# Altium schematic sheet ESP32.SchDoc: ESP32 S3 MQTT SUBSYSTEM
size B; Author: K VOLIN; CompanyName: ASU; DrawnBy: KVOLIN; Engineer: KVOLIN; Revision: 1; SheetNumber: 1; SheetTotal: 1; SPICEModelCachePHAJWFKO: <root> / <DocumentId>PHAJWFKO</DocumentId> / <CacheFrame Number="0"> / <Model Name="diode" Kind="MDL"> / <Text>.MODEL diode D ()</Text> / </Model> / </CacheFrame> / </root>
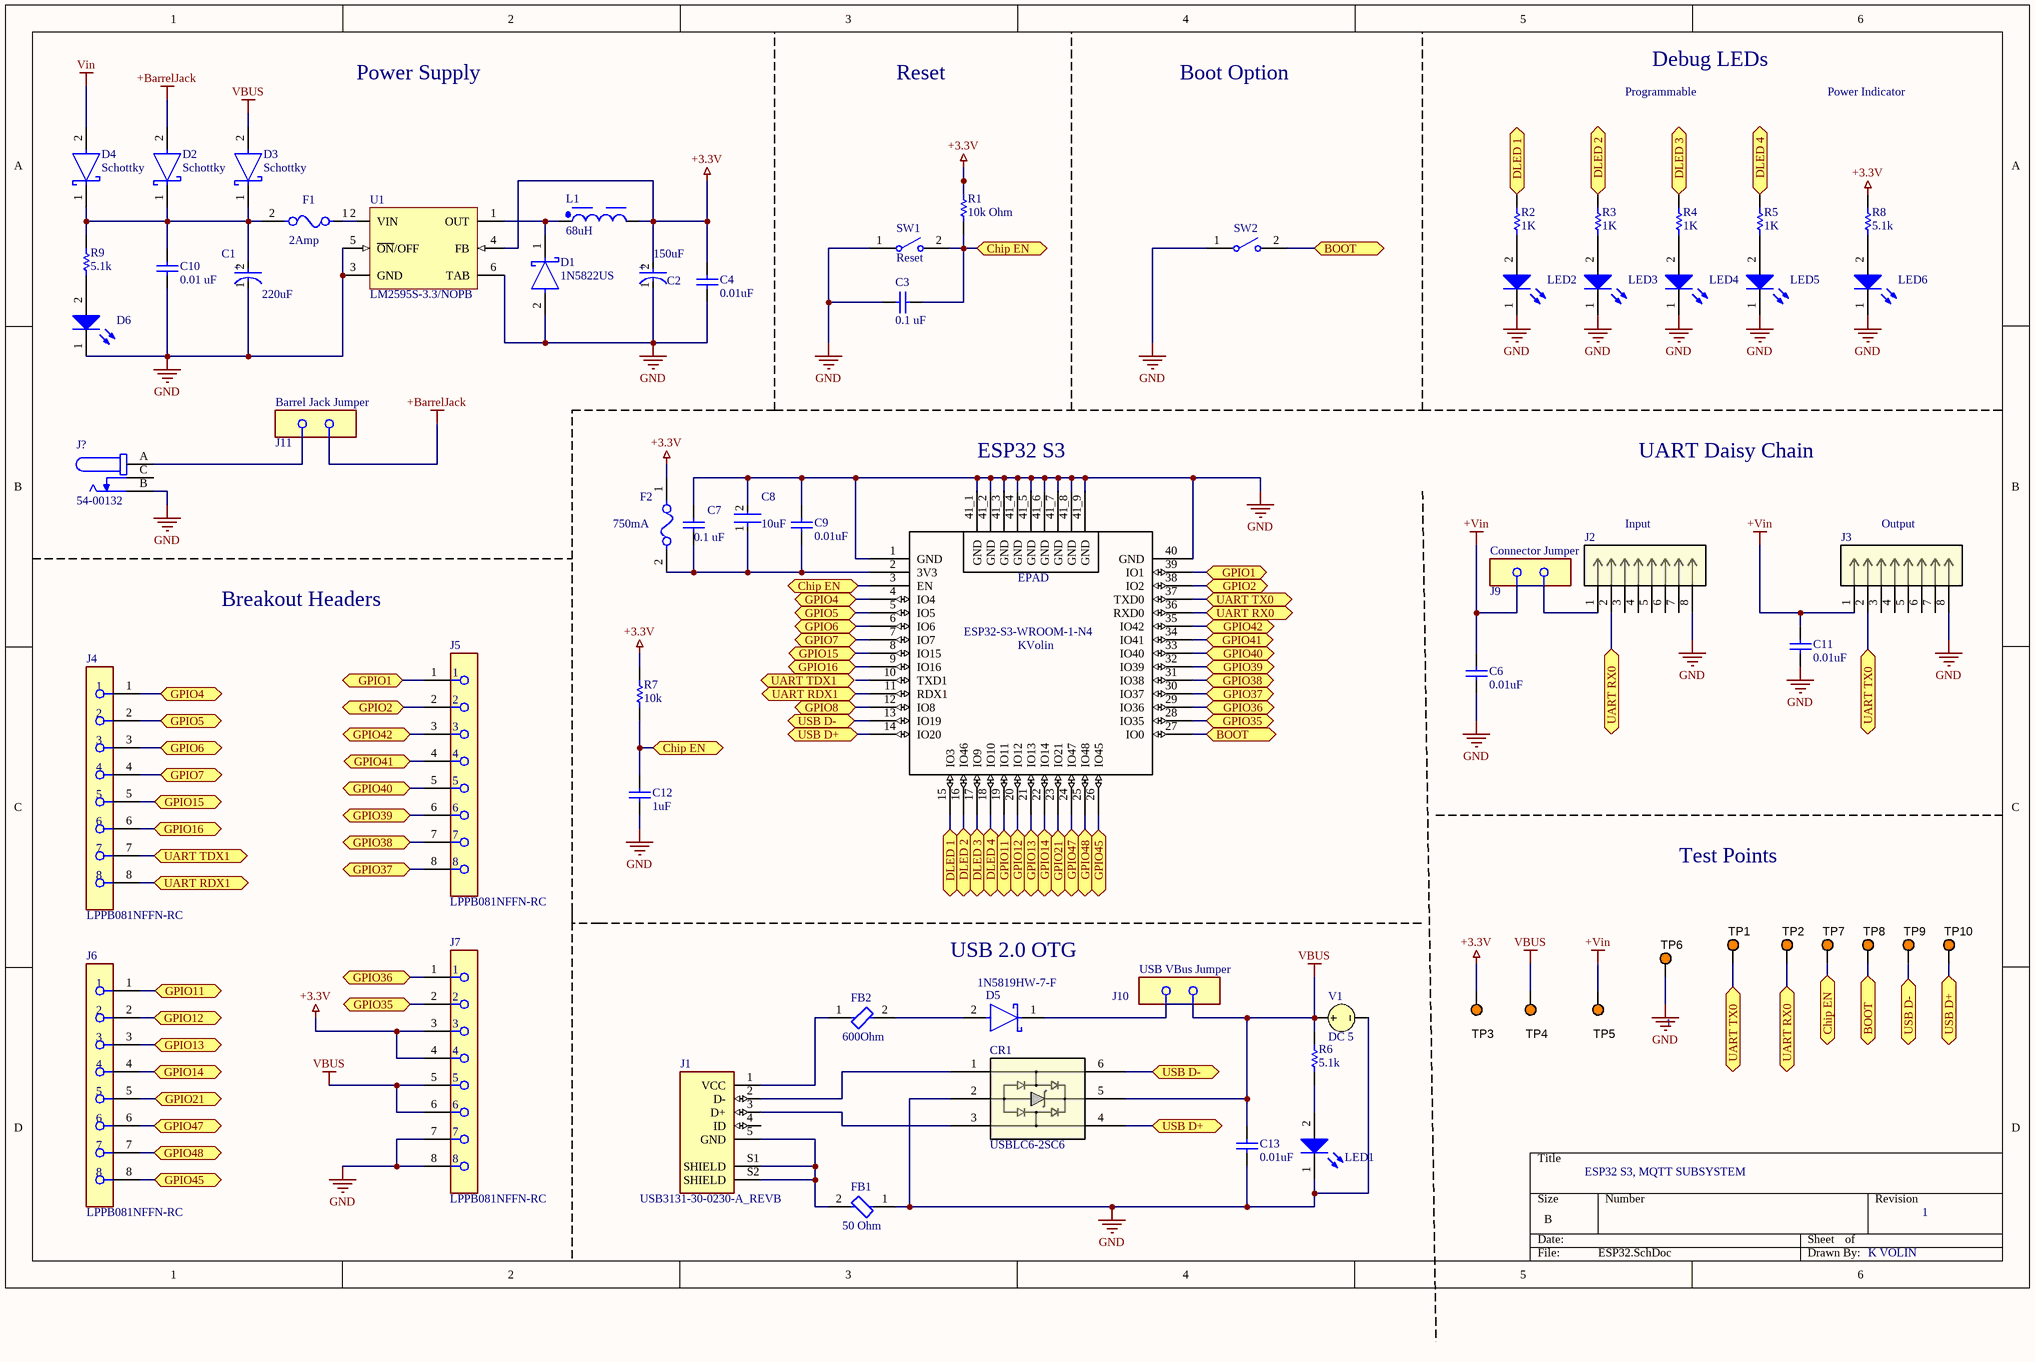
[diagram p0: ESP32.SchDoc]

## Parts
?  ESP32-S3-WROOM-1-N4  (value not drawn)
C1  220uF  [FP-FTD8-MFG]
C2  150uF  [FP-FTC-MFG]
C3  0.1 uF  [CAPC2013X94X50LL20T25]
C4  0.01uF  [CAPC2013X94X50LL20T25]
C6  0.01uF  [CAPC2013X94X50LL20T25]
C7  0.1 uF  [CAPC2013X94X50LL20T25]
C8  10uF  [FP-C0805C106K9PACTU-IPC_B]
C9  0.01uF  [CAPC2013X94X50LL20T25]
C10  0.01 uF  [CAPC2013X94X50LL20T25]
C11  0.01uF  [CAPC2013X94X50LL20T25]
C12  1uF  [CAPC2013X94X50LL20T25]
C13  0.01uF  [CAPC2013X94X50LL20T25]
CR1  USBLC6-2SC6  [SOT23-6L_STM]
D1  1N5822US  [FP-D-5B-MFG]
D2  Schottky  [FP-SOD-323-MFG]
D3  Schottky  [FP-SOD-323-MFG]
D4  Schottky  [FP-SOD-323-MFG]
D5  1N5819HW-7-F  [FP-SOD123-MFG]
D6  150080BS75000  [WL-SMCW_0805_150080xx75000]  (value not drawn)
F1  2Amp  [FP-0466-MFG]
F2  750mA  [FP-0466-MFG]
FB1  50 Ohm  [FP-HI1206T500R-10-IPC_A]
FB2  600Ohm  [FP-MPZ1608-0_8-MFG]
J1  USB3131-30-0230-A_REVB  [GCT_USB3131-30-0230-A_REVB]
J2  Input  [CONN_7024608xx_MOL]
J3  Output  [CONN_7024608xx_MOL]
J4  LPPB081NFFN-RC  [FP-LPPB081NFFN-RC-MFG]
J5  LPPB081NFFN-RC  [FP-LPPB081NFFN-RC-MFG]
J6  LPPB081NFFN-RC  [FP-LPPB081NFFN-RC-MFG]
J7  LPPB081NFFN-RC  [FP-LPPB081NFFN-RC-MFG]
J9  Connector Jumper  [FP-15-29-1025-MFG]
J10  USB VBus Jumper  [FP-15-29-1025-MFG]
J11  Barrel Jack Jumper  [FP-15-29-1025-MFG]
J?  54-00132  [TENSILITY_54-00132]
L1  68uH  [WE-PD_1260]
LED1  150080BS75000  [WL-SMCW_0805_150080xx75000]  (value not drawn)
LED2  150080BS75000  [WL-SMCW_0805_150080xx75000]  (value not drawn)
LED3  150080BS75000  [WL-SMCW_0805_150080xx75000]  (value not drawn)
LED4  150080BS75000  [WL-SMCW_0805_150080xx75000]  (value not drawn)
LED5  150080BS75000  [WL-SMCW_0805_150080xx75000]  (value not drawn)
LED6  150080BS75000  [WL-SMCW_0805_150080xx75000]  (value not drawn)
R1  10k Ohm  [RESC2013X70X40NL20T20]
R2  1K  [RESC2013X60X35NL10T20]
R3  1K  [RESC2013X60X35NL10T20]
R4  1K  [RESC2013X60X35NL10T20]
R5  1K  [RESC2013X60X35NL10T20]
R6  5.1k  [RESC2013X60X35NL10T20]
R7  10k  [RESC2013X60X35NL10T20]
R8  5.1k  [RESC2013X60X35NL10T20]
R9  5.1k  [RESC2013X60X35NL10T20]
SW1  Reset  [434111025826]
SW2  434111025826  [434111025826]  (value not drawn)
TP1  5003  [KSTN-5003]  (value not drawn)
TP2  5003  [KSTN-5003]  (value not drawn)
TP3  5003  [KSTN-5003]  (value not drawn)
TP4  5003  [KSTN-5003]  (value not drawn)
TP5  5003  [KSTN-5003]  (value not drawn)
TP6  5003  [KSTN-5003]  (value not drawn)
TP7  5003  [KSTN-5003]  (value not drawn)
TP8  5003  [KSTN-5003]  (value not drawn)
TP9  5003  [KSTN-5003]  (value not drawn)
TP10  5003  [KSTN-5003]  (value not drawn)
U1  LM2595S-3.3/NOPB  [KTT0005B_N]
V1  DC 5

## Ports
BOOT (bidir, see ESP32[4A], ESP32[4C]), BOOT (bidir, see ESP32[4A], ESP32[6D]), BOOT (bidir, see ESP32[4C], ESP32[6D]), Chip EN (bidir, see ESP32[2C], ESP32[3A], ESP32[3B]), Chip EN (bidir, see ESP32[2C], ESP32[3A], ESP32[6D]), Chip EN (bidir, see ESP32[2C], ESP32[3B], ESP32[6D]), Chip EN (bidir, see ESP32[3A], ESP32[3B], ESP32[6D]), DLED 1 (bidir, see ESP32[3C]), DLED 1 (bidir, see ESP32[5A]), DLED 2 (bidir, see ESP32[3C]), DLED 2 (bidir, see ESP32[5A]), DLED 3 (bidir, see ESP32[3C]), DLED 3 (bidir, see ESP32[5A]), DLED 4 (bidir, see ESP32[3C]), DLED 4 (bidir, see ESP32[6A]), GPIO1 (bidir, see ESP32[2C]), GPIO1 (bidir, see ESP32[4B]), GPIO2 (bidir, see ESP32[2C]), GPIO2 (bidir, see ESP32[4B]), GPIO4 (bidir, see ESP32[1C]), GPIO4 (bidir, see ESP32[3B]), GPIO5 (bidir, see ESP32[1C]), GPIO5 (bidir, see ESP32[3B]), GPIO6 (bidir, see ESP32[1C]), GPIO6 (bidir, see ESP32[3B]), GPIO7 (bidir, see ESP32[1C]), GPIO7 (bidir, see ESP32[3B]), GPIO8 (bidir), GPIO11 (bidir, see ESP32[1D]), GPIO11 (bidir, see ESP32[3C]), GPIO12 (bidir, see ESP32[1D]), GPIO12 (bidir, see ESP32[4C]), GPIO13 (bidir, see ESP32[1D]), GPIO13 (bidir, see ESP32[4C]), GPIO14 (bidir, see ESP32[1D]), GPIO14 (bidir, see ESP32[4C]), GPIO15 (bidir, see ESP32[1C]), GPIO15 (bidir, see ESP32[3C]), GPIO16 (bidir, see ESP32[1C]), GPIO16 (bidir, see ESP32[3C]), GPIO21 (bidir, see ESP32[1D]), GPIO21 (bidir, see ESP32[4C]), GPIO35 (bidir, see ESP32[2D]), GPIO35 (bidir, see ESP32[4C]), GPIO36 (bidir, see ESP32[2D]), GPIO36 (bidir, see ESP32[4C]), GPIO37 (bidir, see ESP32[2C]), GPIO37 (bidir, see ESP32[4C]), GPIO38 (bidir, see ESP32[2C]), GPIO38 (bidir, see ESP32[4C]), GPIO39 (bidir, see ESP32[2C]), GPIO39 (bidir, see ESP32[4C]), GPIO40 (bidir, see ESP32[2C]), GPIO40 (bidir, see ESP32[4C]), GPIO41 (bidir, see ESP32[2C]), GPIO41 (bidir, see ESP32[4B]), GPIO42 (bidir, see ESP32[2C]), GPIO42 (bidir, see ESP32[4B]), GPIO45 (bidir, see ESP32[1D]), GPIO45 (bidir, see ESP32[4C]), GPIO47 (bidir, see ESP32[1D]), GPIO47 (bidir, see ESP32[4C]), GPIO48 (bidir, see ESP32[1D]), GPIO48 (bidir, see ESP32[4C]), UART RDX1 (bidir, see ESP32[1C]), UART RDX1 (bidir, see ESP32[3C]), UART RX0 (bidir, see ESP32[4B], ESP32[5C]), UART RX0 (bidir, see ESP32[4B], ESP32[6D]), UART RX0 (bidir, see ESP32[5C], ESP32[6D]), UART TDX1 (bidir, see ESP32[1C]), UART TDX1 (bidir, see ESP32[3C]), UART TX0 (bidir, see ESP32[4B], ESP32[6C]), UART TX0 (bidir, see ESP32[4B], ESP32[6D]), UART TX0 (bidir, see ESP32[6C], ESP32[6D]), USB D+ (bidir, see ESP32[3C], ESP32[4D]), USB D+ (bidir, see ESP32[3C], ESP32[6D]), USB D+ (bidir, see ESP32[4D], ESP32[6D]), USB D- (bidir, see ESP32[3C], ESP32[4D]), USB D- (bidir, see ESP32[3C], ESP32[6D]), USB D- (bidir, see ESP32[4D], ESP32[6D])

## Nets
+3.3V: C2.2(A) C4.2 F2.1 J7.3 J7.4 L1.2 R1.2 R7.2 R8.1 TP3.1 U1.4(FB)
+BarrelJack: D2.2(A)
+Vin: C6.2 C11.2 J2.1 J3.1 TP5.1
GND: ?.1(GND) ?.40(GND) ?.41_1(GND) ?.41_2(GND) ?.41_3(GND) ?.41_4(GND) ?.41_5(GND) ?.41_6(GND) ?.41_7(GND) ?.41_8(GND) ?.41_9(GND) C1.1(C) C2.1(C) C3.1 C4.1 C6.1 C7.1 C8.2 C9.2 C10.1 C11.1 C12.1 C13.1 CR1.2 D1.2(A) D6.1(K) FB1.1 J2.8 J3.8 J7.7 J7.8 J?.B LED1.1(K) LED2.1(K) LED3.1(K) LED4.1(K) LED5.1(K) LED6.1(K) SW1.1 SW2.1 TP6.1 U1.3(GND) U1.5(~{ON}/OFF) U1.6(TAB) V1.2
VBUS: C13.2 CR1.5 D3.2(A) D5.1(C) J7.5 J7.6 R6.2 TP4.1 V1.1
Vin: D4.2(A)
BOOT: ?.27(IO0) SW2.2 TP8.1 ; port BOOT
Chip EN: ?.3(EN) C3.2 C12.2 R1.1 R7.1 SW1.2 TP7.1 ; port Chip EN
DLED 1: ?.15(IO3) R2.2 ; port DLED 1
DLED 2: ?.16(IO46) R3.2 ; port DLED 2
DLED 3: ?.17(IO9) R4.2 ; port DLED 3
DLED 4: ?.18(IO10) R5.2 ; port DLED 4
GPIO1: ?.39(IO1) J5.1 ; port GPIO1
GPIO2: ?.38(IO2) J5.2 ; port GPIO2
GPIO4: ?.4(IO4) J4.1 ; port GPIO4
GPIO5: ?.5(IO5) J4.2 ; port GPIO5
GPIO6: ?.6(IO6) J4.3 ; port GPIO6
GPIO7: ?.7(IO7) J4.4 ; port GPIO7
GPIO8: ?.12(IO8) ; port GPIO8
GPIO11: ?.19(IO11) J6.1 ; port GPIO11
GPIO12: ?.20(IO12) J6.2 ; port GPIO12
GPIO13: ?.21(IO13) J6.3 ; port GPIO13
GPIO14: ?.22(IO14) J6.4 ; port GPIO14
GPIO15: ?.8(IO15) J4.5 ; port GPIO15
GPIO16: ?.9(IO16) J4.6 ; port GPIO16
GPIO21: ?.23(IO21) J6.5 ; port GPIO21
GPIO35: ?.28(IO35) J7.2 ; port GPIO35
GPIO36: ?.29(IO36) J7.1 ; port GPIO36
GPIO37: ?.30(IO37) J5.8 ; port GPIO37
GPIO38: ?.31(IO38) J5.7 ; port GPIO38
GPIO39: ?.32(IO39) J5.6 ; port GPIO39
GPIO40: ?.33(IO40) J5.5 ; port GPIO40
GPIO41: ?.34(IO41) J5.4 ; port GPIO41
GPIO42: ?.35(IO42) J5.3 ; port GPIO42
GPIO45: ?.26(IO45) J6.8 ; port GPIO45
GPIO47: ?.24(IO47) J6.6 ; port GPIO47
GPIO48: ?.25(IO48) J6.7 ; port GPIO48
UART RDX1: ?.11(RDX1) J4.8 ; port UART RDX1
UART RX0: ?.36(RXD0) J2.2 TP2.1 ; port UART RX0
UART TDX1: J4.7 ; port UART TDX1
UART TX0: ?.37(TXD0) J3.2 TP1.1 ; port UART TX0
USB D+: ?.14(IO20) CR1.4 TP10.1 ; port USB D+
USB D-: ?.13(IO19) CR1.6 TP9.1 ; port USB D-
Net?_2: ?.2(3V3) C7.2 C8.1 C9.1 F2.2
NetC1_2: C1.2(A) C10.2 D2.1(C) D3.1(C) D4.1(C) F1.2 R9.2
NetCR1_1: CR1.1 J1.2(D-)
NetCR1_3: CR1.3 J1.3(D+)
NetD1_1: D1.1(C) L1.1 U1.1(OUT)
NetD5_2: D5.2(A) FB2.2
NetD6_2: D6.2(A) R9.1
NetF1_1: F1.1 U1.2(VIN)
NetFB1_2: FB1.2 J1.5(GND) J1.S1(SHIELD) J1.S2(SHIELD)
NetFB2_1: FB2.1 J1.1(VCC)
NetLED1_2: LED1.2(A) R6.1
NetLED2_2: LED2.2(A) R2.1
NetLED3_2: LED3.2(A) R3.1
NetLED4_2: LED4.2(A) R4.1
NetLED5_2: LED5.2(A) R5.1
NetLED6_2: LED6.2(A) R8.2

Not connected (* = marked no-connect by the designer): ? 10(TXD1); J1 4(ID); J2 3 4 5 6 7; J3 3 4 5 6 7; J? A C

## Notes on the sheet
- Power Supply
- Reset
- Boot Option
- Programmable
- Debug LEDs
- Power Indicator
- ESP32 S3
- UART Daisy Chain
- Breakout Headers
- Test Points
- USB 2.0 OTG
- 1
- ESP32 S3, MQTT SUBSYSTEM
- K VOLIN
- (in symbol CMP-00287-21274267-1) +
- (in symbol CMP-05427-000088-1) +
- (in symbol ESP32-S3-WROOM-1-N4) EPAD; KVolin

## Library data of the parts
C1 = CMP-05427-000088-1: CAP ALUM 220UF 20% 25V SMD EEEFT1C221AP; Dielectric Material: Aluminium; ESR (Equivalent Series Resistance): 160mR; Ripple Current: 600mA; Life (Hours): 2000Hour; Leakage Current: 55uA; Lead Diameter: 0.65mm; Series: FT; RoHS Compliant: Yes; Case/Package: Radial; Packaging: Tape and Reel; Contact Plating: Tin; Package Quantity: 1; Mount: Surface Mount; Number of Pins: 8; Tolerance: 20%; Height - Seated (Max): 0.315inch; Length: 7.7mm; Lead Free: Lead Free; Voltage: 25V; Construction: Cylindrical; Radiation Hardening: No; Lead Pitch: 1.8mm; REACH SVHC: No SVHC; Capacitance: 220uF; Voltage Rating: 25V; Height: 7.7mm; Diameter: 6.3mm; Max Operating Temperature: 105°C; Termination: SMD/SMT; Min Operating Temperature: -55°C; Voltage Rating (DC): 25V; Ripple Current (AC): 600mA; Value: 220uF
C2 = CMP-00287-21274267-1: EEEFT1A151AR Aluminum Electrolytic Capacitor, 150 uF, 10 V, ± 20%, 2000 hours @ 105°C, Radial Can - SMD; Capacitance: 150µF; Voltage Rating: 10V; Leakage Current: 15µA; Ripple Current (AC): 240mA; Lead Diameter: 650µm; Dissipation Factor: 19%; ESR (Equivalent Series Resistance): 360mΩ; Value: 150µF; REACH SVHC: No SVHC; Max Operating Temperature: 105°C; Features: General Purpose; Height - Seated (Max): 6.096mm; Packaging: Cut Tape; Lead Pitch: 1.5mm; Case/Package: Radial; Height: 5.8mm; NexarPartId: 21274267; Contact Plating: Tin; Tolerance: 20%; Voltage Rating (DC): 10V; Lifecycle Status: Production; Schedule B: 8532220020, 8532220020|8532220020, 8532220020|8532220020|8532220020, 8532220020|8532220020|8532220020|8532220020; Ripple Current: 240mA; Radiation Hardening: No; Mount: Surface Mount; Min Operating Temperature: -55°C; Voltage: 10V; Length: 5.8mm; Termination: SMD/SMT; Life (Hours): 2000hours; Lead Free: Lead Free; Diameter: 5mm; RoHS: Compliant
C3 C4 C6 C7 C9-C13 = CMP-2007-04373-1: Manufacturer: AVX Interconnect / Elco; Part Number: 08055C104MAT2A
C8 = CMP-03020-034676-1: CAP CER 10UF 6.3V X5R 0805; Dielectric Material: Ceramic; Dissipation Factor: 5%; Tolerance: 10%; Capacitance: 10uF; Thickness: 0.055inch; Mount: Surface Mount; Voltage: 6.3V; Case Code (Imperial): 0805; Lead Pitch: 0.75mm; Height: 1.25mm; Construction: Flat; Number of Pins: 2; Contact Material: Tin; Case/Package: 0805; Case Code (Metric): 2012; Termination: SMD/SMT; Width: 1.2mm; Dielectric: X5R; Lead Free: Lead Free; Min Operating Temperature: -55°C; Voltage Rating (DC): 6.3V; Series: C; Packaging: Tape and Reel; Radiation Hardening: No; Length: 2mm; REACH SVHC: No SVHC; RoHS Compliant: Yes; Max Operating Temperature: 85°C; Package Quantity: 1; Voltage Rating: 6.3V; Depth: 1.25mm; Value: 10uF
CR1 = USBLC6-2SC6: No Description Available; Mfr_Name: STMicroelectronics; RefDes: RefDes; Type: Type
D1 = CMP-06358-000022-1: DIODE SCHOTTKY 40V 3A B-MELF
D2-D4 = CMP-56206-000009-1: DIODE SCHOTTKY 40V 1A SOD323; Max Reverse Leakage Current: 1mA; Peak Non-Repetitive Surge Current: 10A; Forward Voltage: 900mV; Element Configuration: Single; Max Reverse Voltage (DC): 40V; Number of Pins: 2; Max Operating Temperature: 125°C; Package Quantity: 1; Radiation Hardening: No; Average Rectified Current: 1A; Lead Free: Lead Free; Series: -; Mount: Surface Mount; Min Operating Temperature: -65°C; RoHS Compliant: Yes; Packaging: Tape and Reel; Max Surge Current: 10A
D5 = CMP-0303-00003-3: DIODE SCHOTTKY 40V 1A SOD123; Forward Voltage: 450mV; Capacitance: 110pF; Max Forward Surge Current (Ifsm): 25A; Peak Reverse Current: 50uA; Polarity: Standard; Element Configuration: Single; Max Power Dissipation: 450mW; Min Operating Temperature: -65°C; Package Quantity: 3000; Contact Plating: Tin; Weight: 0.000353oz; Max Repetitive Reverse Voltage (Vrrm): 40V; Max Reverse Voltage (DC): 40V; Height: 1.25mm; Average Rectified Current: 1A; Width: 1.7mm; Case/Package: SOD-123-2; Lead Free: Lead Free; Max Operating Temperature: 125°C; Current Rating: 1A; Termination: SMD/SMT; Forward Current: 1A; Radiation Hardening: No; Number of Pins: 2; Length: 2.85mm; Voltage Rating (DC): 40V; REACH SVHC: No SVHC; Peak Non-Repetitive Surge Current: 25A; Packaging: Tape and Reel; Output Current: 1A
D6 LED1-LED6 = CMP-1426-00008-7: Led, Blue, 470 Nm, 3.2 V, 30 Ma, 145 Mcd Rohs Compliant: Yes |Wurth Elektronik 150080BS75000; Dominant Wavelength: 470nm; Max Junction Temperature (Tj): 95°C; Power Dissipation: 105mW; Peak Wavelength: 465nm; Max Reverse Voltage (DC): 5V; Forward Current: 100mA; Test Current: 20mA; Luminous Intensity: 145mcd; Lens Style: Clear, Rectangular; Viewing Angle: 140°; Forward Voltage: 3.2V; Color: Blue; Height: 700µm; Case Code (Imperial): 0805; Width: 1.25mm; REACH SVHC: Unknown; Case/Package: 0805; Lead Free: Lead Free; Mount: Surface Mount; Packaging: Tape and Reel; RoHS: Compliant; Reverse Voltage: 5V; Min Operating Temperature: -40°C; Case Code (Metric): 2012; Wavelength: 470nm; Max Operating Temperature: 85°C; Length: 2mm
F1 F2 = CMP-2000-05742-2: FUSE BOARD MNT 2A 63VAC/VDC 1206; Manufacturer: Littelfuse; Manufacturer Part Number: 0466002.NR; Max Fuse Dc Voltage: 63V; Fuse I2T: 0.2326A2Sec; Fuse Voltage Drop: 78.73mV; Fuse Interrupt Ac Current: 50A; Resistance: 0.03Ω; Value: 0.03Ω; Fuse Blow Speed: Fast; Temperature Range Low: -55°C; Octopart: https://octopart.com/0466002.nr-littelfuse-566006; Category: Fuse; Digikey Description: FUSE BOARD MNT 2A 63VAC/VDC 1206; Height: 0.66mm; Temperature: -55°C to +90°C; ComponentLink2URL: https://www.littelfuse.com/~/media/electronics/datasheets/fuses/littelfuse_fuse_466_datasheet.pdf.pdf; Device Class L3: unset; Device Class L2: Fuses; Device Class L1: Circuit Protection; Lead Free: Yes; Mouser Description: 466 Series Very Fast-Acting 63 V 2 A 1206 Surface Mount Thin Film Fuse; Package: 0466; Fuse Current: 2A; Temperature Range High: +90°C; Voltage Rating: 63V; Automotive: No; Max Fuse Ac Voltage: 63V; ComponentLink2Description: Datasheet; RoHS: TRUE; Fuse Interrupt Dc Current: 50A
FB1 = CMP-2000-06407-2: FERRITE BEAD 50 OHM 1206 1LN; Impedance: 50R; Max DC Current: 6A; Frequency: 100MHz; Number of Lines: 1; DC Resistance (DCR): 10mR; Core Material: Ferrite; Max Operating Temperature: 125°C; Weight: 0.000944oz; Width: 0.063inch; Termination: SMD/SMT; Case Code (Imperial): 1206; Contact Plating: Tin; Material: Ferrite; Current Rating: 6A; Height: 0.051inch; RoHS Compliant: Yes; Case Code (Metric): 3216; Package Quantity: 1; Depth: 1.8mm; Min Operating Temperature: -40°C; Lead Free: Lead Free; Test Frequency: 100MHz; Packaging: Tape and Reel; Case/Package: 1206; Mount: Surface Mount; Series: HI; Max Current Rating: 6A; Length: 3.2mm
FB2 = CMP-08257-000179-1: Power line Ferrite Bead 600Ω @ 100MHz 1A DCR 0.15Ω SMD 0603; Impedance: 600R; DC Resistance (DCR): 150mR; Tolerance: 25%; Depth: 0.8mm; Packaging: Tape and Reel; Package Quantity: 4000; Height: 0.8mm; Length: 0.063inch; Series: MPZ; Weight: 7.1E-05oz; Width: 0.8mm; Mount: Surface Mount; Case Code (Imperial): 0603; Case/Package: 0603; Max Operating Temperature: 125°C; Max DC Current: 1A; Test Frequency: 100MHz; Min Operating Temperature: -55°C; Current Rating: 1A; Core Material: Ferrite; RoHS Compliant: Yes; REACH SVHC: No SVHC; Case Code (Metric): 1608; Termination: SMD/SMT; Lead Free: Lead Free
J1 = USB3131-30-0230-A_REVB: USB - micro B USB 2.0 Receptacle Connector 5 Position Through Hole; Availability: Unavailable; MP: USB3131-30-0230-A_REVB; Value: *; Package: None; Price: None
J2 J3 = 702460801: No Description Available; Mfr_Name: Molex Connector Corporation; RefDes: RefDes; Type: Type
J4-J7 = CMP-25680-000039-1: CONN HDR 8POS 0.05 GOLD PCB; Connector Type: Header; Pitch: 0.05inch; Number of Positions: 8; Packaging: Bulk; Contact Type: Female Socket; Termination: Solder; RoHS Compliant: Yes; Lead Free: Lead Free; Package Quantity: 1; Mount: Through Hole; Contact Plating: Gold; Number of Rows: 1
J9-J11 = CMP-04762-000006-1: CONN SHUNT CLOSED TOP .100 GOLD; Contact Resistance: 15mR; Number of Circuits: 2; Gender: Female; Insulation Resistance: 100GR; Approvals: UL; Body Material: Polyester; Primary Type: Rectangular; Pitch: 2.54mm; Current Rating: 5A; Height: 0.347inch; Packaging: Bag; ELV: Compliant; Package Quantity: 10000; Width: 2.54mm; Contact Material: Bronze; Series: C-Grid® 7859; Contact Gender: Female; Material: Bronze; Termination: Solder; Depth: 8.81mm; Orientation: Straight; Min Operating Temperature: -40°C; Length: 5.08mm; Max Operating Temperature: 105°C; Number of Positions: 2; Flammability Rating: UL94 V-0; Housing Material: Polyester; Radiation Hardening: No; Housing Color: Black; Lead Free: Lead Free; Number of Contacts: 2; RoHS Compliant: Yes; Number of Rows: 1; Contact Plating: Gold; Color: Black
J? = 54-00132: Connector, dc jack 5.5x2.5 mm, PCB mount, 90 degrees, silver plated, board lock; MF: Tensility International Corp; Package: None; Price: None; Check_prices: https://www.snapeda.com/parts/54-00132/Tensility+International+Corp/view-part/?ref=eda; Value: *; SnapEDA_Link: https://www.snapeda.com/parts/54-00132/Tensility+International+Corp/view-part/?ref=snap; MP: 54-00132; Availability: In Stock; Purchase-URL: https://pricing.snapeda.com/search?q=54-00132&ref=eda
L1 = CMP-0227-00736-2: NexarPartId: 8917134; Max DC Current: 1.91A; Shielding: Shielded; Series Resistance: 120mΩ; DC Resistance (DCR): 86mΩ; Core Material: Ferrite; Saturation Current: 2.19A; Inductance: 68µH; Current Rating: 2A; Self Resonant Frequency: 6MHz; Test Frequency: 1kHz; Tolerance: 20%; Value: 68µH; REACH SVHC: Unknown; Width: 12mm; RoHS: Compliant; Height - Seated (Max): 5.9944mm; Min Operating Temperature: -40°C; Max Operating Temperature: 125°C; Weight: 4.535924g; Mount: Surface Mount; Resistance: 120mΩ; Number of Pins: 2; Depth: 12mm; Case/Package: Nonstandard; Height: 6mm; RMS Current (Irms): 1.91A; Composition: Wirewound; Lead Free: Lead Free; Length: 12mm; Inductance Tolerance: 20%; Ambient Temperature Range High: 85°C; Packaging: Tape & Reel (TR); Termination: SMD/SMT; Ambient Temperature Range Low: -40°C
R1 = CMP-2001-00337-1: Part Number: ERJ-6GEYJ103V; Manufacturer: Panasonic
R2-R9 = CMP-2100-03671-1: Chip Resistor, 1 KOhm, +/- 1%, 125 mW, -55 to 155 degC, 0805 (2012 Metric), RoHS, Tape and Reel; Manufacturer: Yageo; Temperature Coefficient: 100ppm/degreesC; Voltage Rating (DC): 150V; Max Power Dissipation: 125mW; Resistance: 1KOhm; Value: 1KOhm; Number of Pins: 2; Number of Terminations: 2; Datasheet URL: http://www.yageo.com/NewPortal/yageodocoutput?fileName=/pdf/R-Chip/PYu-RC_Group_51_RoHS_L_5.pdf; Length: 0.079inch; Package Description: 2-Pin Surface Mounted Device, Body 2 x 1.25 mm; Depth: 1.25mm; Height: 0.024inch; Military Standard: Not; Case/Package: 0805; Package Reference: 0805; RoHSCompliant: true; Lead Free: LeadFree; Packaging: TapeandReel; Package Quantity: 1; Datasheet Version: Rev. 5, 10/2016; Tolerance: 1%; Min Operating Temperature: -55degC; Voltage Rating: 150V; Composition: ThickFilm; Case Code (Imperial): 0805; Power Rating: 125mW; Width: 0.049inch; Case Code (Metric): 2012; Manufacturer URL: http://www.yageo.com/; Max Operating Temperature: 155degC; REACH SVHC: Unknown; Termination: SMD/SMT
SW1 SW2 = CMP-1459-00001-3: Switch Tactile Spst-no 0.05A 12V; Contact Current Rating: 50mA; Switch Travel: 250µm; Contact Resistance: 100mΩ; Operating Force: 260N; Throw Configuration: SPST; Mechanical Life: 30kcycles; Actuator Length: 800µm; Illumination Type: Illuminated, Non-Illuminated; Actuator Material: Liquid Crystal Polymer, Polymer; Switch Function: Off-Mom; Termination: SMD/SMT; REACH SVHC: No SVHC; Packaging: Tape and Reel; RoHS: Compliant; Contact Plating: Silver; Color: White; Insulation Resistance: 100MΩ; Current Rating: 50mA; Mount: Surface Mount; Max Operating Temperature: 85°C; Contact Material: Stainless Steel, Steel; Height: 2.5mm; Voltage Rating: 12V; Length: 7.3mm; Lead Free: Lead Free; Min Operating Temperature: -40°C
TP1-TP10 = CMP-1672-00009-1: Test Point, Orange, 1-Pin THD, RoHS; Peak Reverse Current: 600 uA; Forward Current: 3 A; Max Surge Current: 80 A; Forward Voltage: 1.08 V; Max Operating Temperature: 150 degC; PackageReference: 5003; Pins: 2; ComponentLink2URL: http://keyelco.com/userAssets/file/M65p56.pdf; PackageDescription: 1-Pin Through Hole Device, Dia 2.54 mm; Weight: 0.01 lb; Diameter: 5.3 mm; Mount: Through Hole; Package Quantity: 500; Packaging: Bulk; Min Operating Temperature: -65 degC; ComponentLink1Description: Manufacturer URL; Height: 0.25 inch; ComponentLink1URL: http://www.keyelco.com/; ComponentLink2Description: Datasheet; Width: 0.25 inch; REACH SVHC: No SVHC; RoHSCompliant: true; Radiation Hardening: No; Length: 9.5 mm; DatasheetVersion: Jun-15
U1 = CMP-0069-00229-3: SIMPLE SWITCHER® Power Converter 150 KHz 1A Step-Down Voltage Regulator, 5-pin TO-263, Pb-Free; Manufacturer: Texas Instruments; PackageTopMarking: NSUZXYTTE#*LM2595S*-3.3 P+; PowerWise: N; PackageReference: KTT0005B; RoHS: Y; Code_JEDEC: MO-169-AB; PackageDescription: TO-263, Molded, .400 x .390 x .180in, 5 Lead, .067in Pitch, Surface Mount; CompType: Switcher; ComponentLink1Description: Datasheet URL; PinCount: 5; ComponentLink1URL: http://www.ti.com/general/docs/lit/getliterature.tsp?genericPartNumber=LM2595&fileType=pdf
V1 = VSRC: Voltage Source; Note: PCB Footprint - Not required; AC Magnitude: 1; AC Phase: 0; Value: 5; Published: 8-Jun-2000; LatestRevisionDate: 17-Jul-2002; LatestRevisionNote: Re-released for DXP Platform.; PackageReference: Not Applicable; Publisher: Altium Limited